# EAGLE schematic board1 (EAGLE 9.4.2)

## Sheet 1 of 2
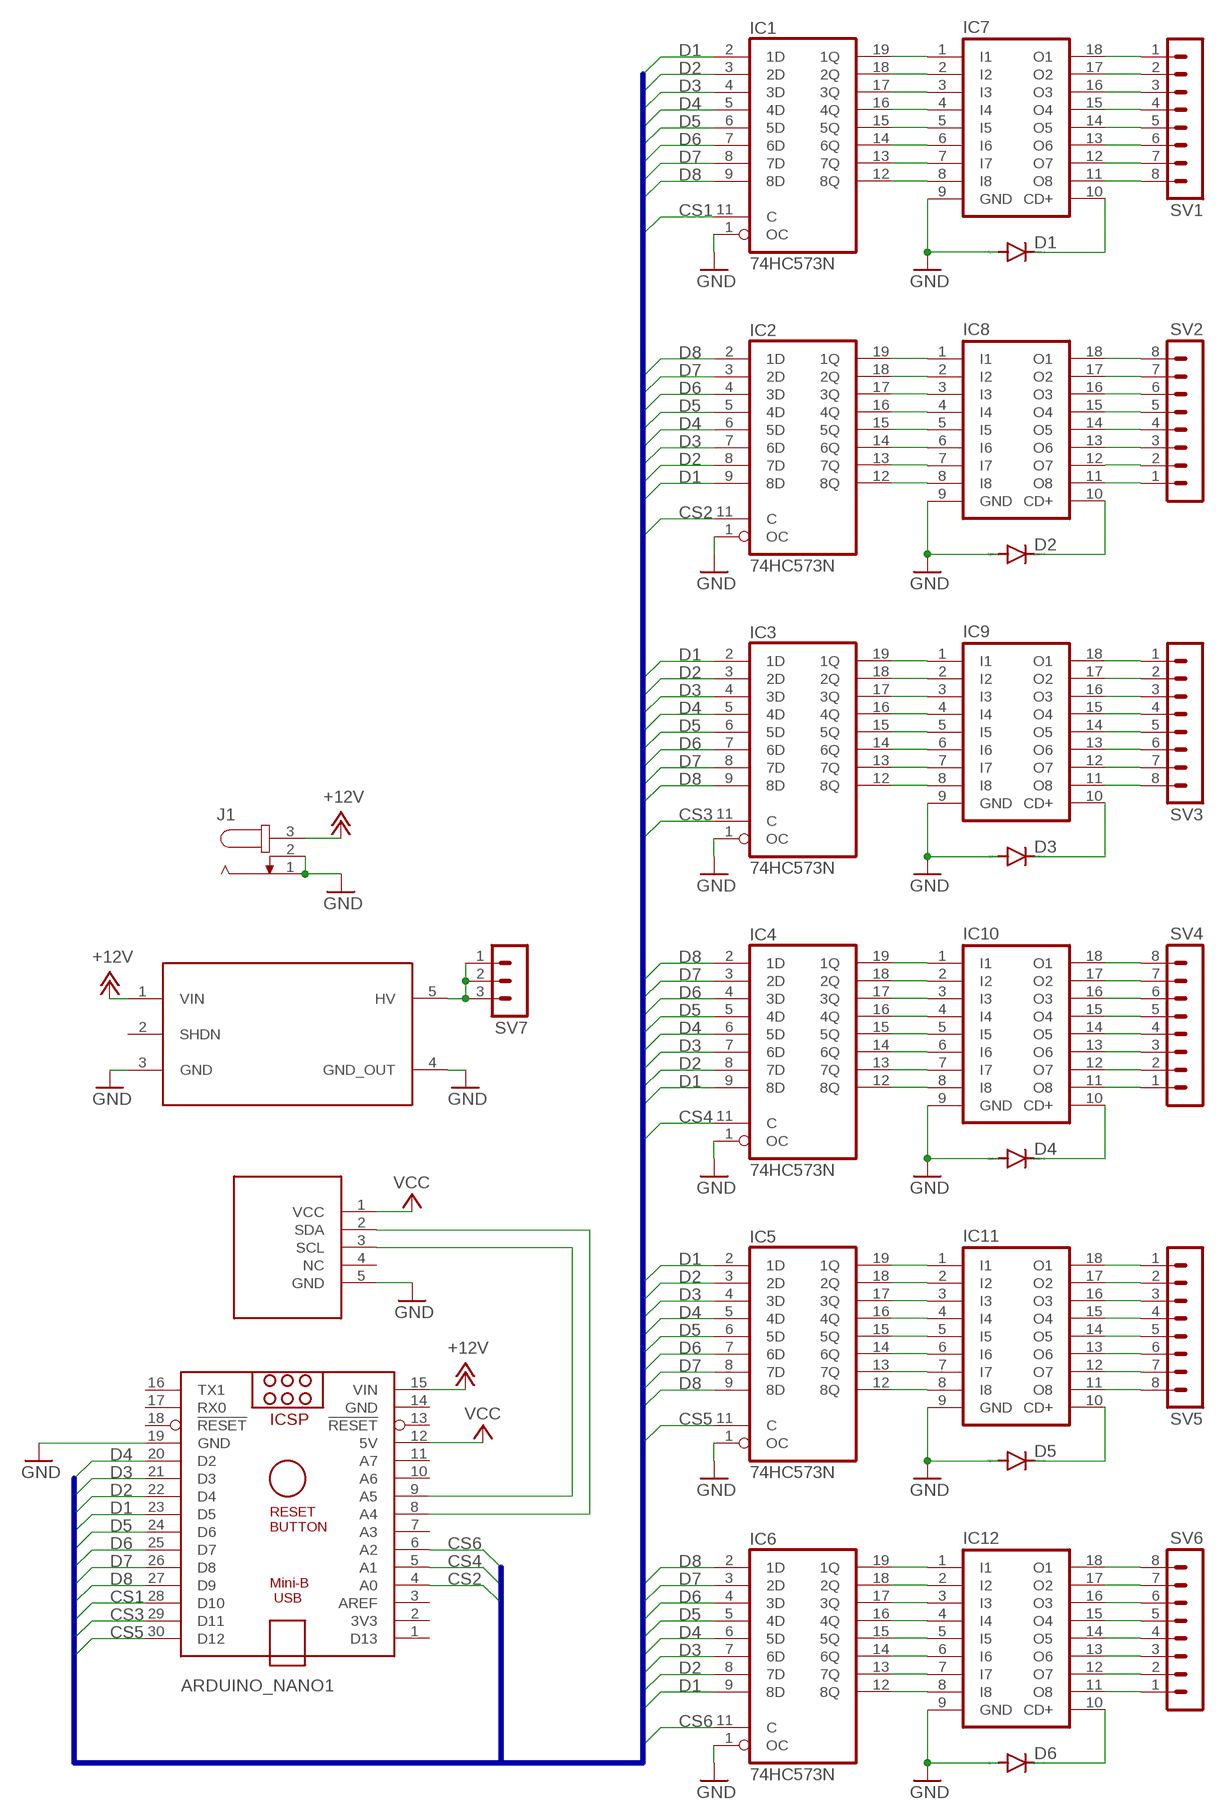
[diagram p0: schematic, sheet 1]

### Parts
ARDUINO_NANO1  ARDUINO_NANO  [ARDUINO_NANO]
D1  DIODE-D-7.5  [D-7.5]
D2  DIODE-D-7.5  [D-7.5]
D3  DIODE-D-7.5  [D-7.5]
D4  DIODE-D-7.5  [D-7.5]
D5  DIODE-D-7.5  [D-7.5]
D6  DIODE-D-7.5  [D-7.5]
IC1  74HC573N  [DIL20]
IC2  74HC573N  [DIL20]
IC3  74HC573N  [DIL20]
IC4  74HC573N  [DIL20]
IC5  74HC573N  [DIL20]
IC6  74HC573N  [DIL20]
IC7  ULN2803A  [DIL18]
IC8  ULN2803A  [DIL18]
IC9  ULN2803A  [DIL18]
IC10  ULN2803A  [DIL18]
IC11  ULN2803A  [DIL18]
IC12  ULN2803A  [DIL18]
J1  JACK-PLUG0  [SPC4077]
SV1  MA08-1  [MA08-1]
SV2  MA08-1  [MA08-1]
SV3  MA08-1  [MA08-1]
SV4  MA08-1  [MA08-1]
SV5  MA08-1  [MA08-1]
SV6  MA08-1  [MA08-1]
SV7  MA03-1  [MA03-1]
U$1  DS3231_MINI_MODULE  [DS3231_MINI_MODULE]
U$2  MAX1771_NIXIE_MODULE  [MAX1771_NIXIE_MODULE]

### Nets
+12V: ARDUINO_NANO1.15(VIN) J1.3 U$2.1(VIN)
CS1: ARDUINO_NANO1.28(D10) IC1.11(C)
CS2: ARDUINO_NANO1.4(A0) IC2.11(C)
CS3: ARDUINO_NANO1.29(D11) IC3.11(C)
CS4: ARDUINO_NANO1.5(A1) IC4.11(C)
CS5: ARDUINO_NANO1.30(D12) IC5.11(C)
CS6: ARDUINO_NANO1.6(A2) IC6.11(C)
D1: ARDUINO_NANO1.23(D5) IC1.2(1D) IC2.9(8D) IC3.2(1D) IC4.9(8D) IC5.2(1D) IC6.9(8D)
D2: ARDUINO_NANO1.22(D4) IC1.3(2D) IC2.8(7D) IC3.3(2D) IC4.8(7D) IC5.3(2D) IC6.8(7D)
D3: ARDUINO_NANO1.21(D3) IC1.4(3D) IC2.7(6D) IC3.4(3D) IC4.7(6D) IC5.4(3D) IC6.7(6D)
D4: ARDUINO_NANO1.20(D2) IC1.5(4D) IC2.6(5D) IC3.5(4D) IC4.6(5D) IC5.5(4D) IC6.6(5D)
D5: ARDUINO_NANO1.24(D6) IC1.6(5D) IC2.5(4D) IC3.6(5D) IC4.5(4D) IC5.6(5D) IC6.5(4D)
D6: ARDUINO_NANO1.25(D7) IC1.7(6D) IC2.4(3D) IC3.7(6D) IC4.4(3D) IC5.7(6D) IC6.4(3D)
D7: ARDUINO_NANO1.26(D8) IC1.8(7D) IC2.3(2D) IC3.8(7D) IC4.3(2D) IC5.8(7D) IC6.3(2D)
D8: ARDUINO_NANO1.27(D9) IC1.9(8D) IC2.2(1D) IC3.9(8D) IC4.2(1D) IC5.9(8D) IC6.2(1D)
GND: ARDUINO_NANO1.19(GND) D1.A D2.A D3.A D4.A D5.A D6.A IC1.1(OC) IC2.1(OC) IC3.1(OC) IC4.1(OC) IC5.1(OC) IC6.1(OC) IC7.9(GND) IC8.9(GND) IC9.9(GND) IC10.9(GND) IC11.9(GND) IC12.9(GND) J1.1 J1.2 U$1.5(GND) U$2.3(GND) U$2.4(GND_OUT)
N$1: IC2.19(1Q) IC8.1(I1)
N$2: IC2.18(2Q) IC8.2(I2)
N$3: IC2.17(3Q) IC8.3(I3)
N$4: IC2.16(4Q) IC8.4(I4)
N$5: IC2.15(5Q) IC8.5(I5)
N$6: IC2.14(6Q) IC8.6(I6)
N$7: IC2.13(7Q) IC8.7(I7)
N$8: IC2.12(8Q) IC8.8(I8)
N$9: IC1.19(1Q) IC7.1(I1)
N$10: IC1.18(2Q) IC7.2(I2)
N$11: IC1.17(3Q) IC7.3(I3)
N$12: IC1.16(4Q) IC7.4(I4)
N$13: IC1.15(5Q) IC7.5(I5)
N$14: IC1.14(6Q) IC7.6(I6)
N$15: IC1.13(7Q) IC7.7(I7)
N$16: IC1.12(8Q) IC7.8(I8)
N$17: IC3.19(1Q) IC9.1(I1)
N$18: IC3.18(2Q) IC9.2(I2)
N$19: IC3.17(3Q) IC9.3(I3)
N$20: IC3.16(4Q) IC9.4(I4)
N$21: IC3.15(5Q) IC9.5(I5)
N$22: IC3.14(6Q) IC9.6(I6)
N$23: IC3.13(7Q) IC9.7(I7)
N$24: IC3.12(8Q) IC9.8(I8)
N$25: IC4.19(1Q) IC10.1(I1)
N$26: IC4.18(2Q) IC10.2(I2)
N$27: IC4.17(3Q) IC10.3(I3)
N$28: IC4.16(4Q) IC10.4(I4)
N$29: IC4.15(5Q) IC10.5(I5)
N$30: IC4.14(6Q) IC10.6(I6)
N$31: IC4.13(7Q) IC10.7(I7)
N$32: IC4.12(8Q) IC10.8(I8)
N$33: IC5.19(1Q) IC11.1(I1)
N$34: IC5.18(2Q) IC11.2(I2)
N$35: IC5.17(3Q) IC11.3(I3)
N$36: IC5.16(4Q) IC11.4(I4)
N$37: IC5.15(5Q) IC11.5(I5)
N$38: IC5.14(6Q) IC11.6(I6)
N$39: IC5.13(7Q) IC11.7(I7)
N$40: IC5.12(8Q) IC11.8(I8)
N$41: IC6.19(1Q) IC12.1(I1)
N$42: IC6.18(2Q) IC12.2(I2)
N$43: IC6.17(3Q) IC12.3(I3)
N$44: IC6.16(4Q) IC12.4(I4)
N$45: IC6.15(5Q) IC12.5(I5)
N$46: IC6.14(6Q) IC12.6(I6)
N$47: IC6.13(7Q) IC12.7(I7)
N$48: IC6.12(8Q) IC12.8(I8)
N$49: IC7.18(O1) SV1.1
N$50: IC7.17(O2) SV1.2
N$51: IC7.16(O3) SV1.3
N$52: IC7.15(O4) SV1.4
N$53: IC7.14(O5) SV1.5
N$54: IC7.13(O6) SV1.6
N$55: IC7.12(O7) SV1.7
N$56: IC7.11(O8) SV1.8
N$57: IC8.18(O1) SV2.8
N$58: IC8.17(O2) SV2.7
N$59: IC8.16(O3) SV2.6
N$60: IC8.15(O4) SV2.5
N$61: IC8.14(O5) SV2.4
N$62: IC8.13(O6) SV2.3
N$63: IC8.12(O7) SV2.2
N$64: IC8.11(O8) SV2.1
N$65: IC9.18(O1) SV3.1
N$66: IC9.17(O2) SV3.2
N$67: IC9.16(O3) SV3.3
N$68: IC9.15(O4) SV3.4
N$69: IC9.14(O5) SV3.5
N$70: IC9.13(O6) SV3.6
N$71: IC9.12(O7) SV3.7
N$72: IC9.11(O8) SV3.8
N$73: IC10.18(O1) SV4.8
N$74: IC10.17(O2) SV4.7
N$75: IC10.16(O3) SV4.6
N$76: IC10.15(O4) SV4.5
N$77: IC10.14(O5) SV4.4
N$78: IC10.13(O6) SV4.3
N$79: IC10.12(O7) SV4.2
N$80: IC10.11(O8) SV4.1
N$81: IC11.18(O1) SV5.1
N$82: IC11.17(O2) SV5.2
N$83: IC11.16(O3) SV5.3
N$84: IC11.15(O4) SV5.4
N$85: IC11.14(O5) SV5.5
N$86: IC11.13(O6) SV5.6
N$87: IC11.12(O7) SV5.7
N$88: IC11.11(O8) SV5.8
N$89: IC12.18(O1) SV6.8
N$90: IC12.17(O2) SV6.7
N$91: IC12.16(O3) SV6.6
N$92: IC12.15(O4) SV6.5
N$93: IC12.14(O5) SV6.4
N$94: IC12.13(O6) SV6.3
N$95: IC12.12(O7) SV6.2
N$96: IC12.11(O8) SV6.1
N$97: ARDUINO_NANO1.8(A4) U$1.2(SDA)
N$98: D1.C IC7.10(CD+)
N$99: ARDUINO_NANO1.9(A5) U$1.3(SCL)
N$100: D2.C IC8.10(CD+)
N$101: SV7.1 SV7.2 SV7.3 U$2.5(HV)
N$102: D3.C IC9.10(CD+)
N$104: D4.C IC10.10(CD+)
N$106: D5.C IC11.10(CD+)
N$108: D6.C IC12.10(CD+)
VCC: ARDUINO_NANO1.12(5V) U$1.1(VCC)
Unconnected: ARDUINO_NANO1.1(D13) ARDUINO_NANO1.2(3V3) ARDUINO_NANO1.3(AREF) ARDUINO_NANO1.7(A3) ARDUINO_NANO1.10(A6) ARDUINO_NANO1.11(A7) ARDUINO_NANO1.13(!RESET) ARDUINO_NANO1.16(TX1) ARDUINO_NANO1.17(RX0) ARDUINO_NANO1.18(!RESET) U$1.4(NC) U$2.2(SHDN)

### Buses
CS1,CS2,CS3,CS4,CS5,CS6,D1,D2,D3,D4,D5,D6,D7,D8

## Sheet 2 of 2

## Power pins joined to a net without a drawn wire
GND: ARDUINO_NANO1.14(GND) IC1.10(GND) IC2.10(GND) IC3.10(GND) IC4.10(GND) IC5.10(GND) IC6.10(GND)
VCC: IC1.20(VCC) IC2.20(VCC) IC3.20(VCC) IC4.20(VCC) IC5.20(VCC) IC6.20(VCC)

## Library data of the parts
ARDUINO_NANO1 = ArduinoNanoV30:ARDUINO_NANO: Arduino Nano V3.0 Overview: The Arduino Nano is a small, complete, and breadboard-friendly board based on the ATmega328 (Arduino Nano 3.x) or ATmega168 (Arduino Nano 2.x). It has more or less the same functionality of the Arduino Duemilanove, but in a different package. It lacks only a DC power jack, and works with a Mini-B USB cable instead of a standard one. The Nano was designed and is being produced by Gravitech. Specifications: Microcontroller Atmel ATmega168 or ATmega328 Operating Voltage (logic level) 5 V Input Voltage (recommended) 7-12 V Input Voltage (limits) 6-20 V Digital I/O Pins 14 (of which 6 provide PWM output) Analog Input Pins 8 DC Current per I/O Pin 40 mA Flash Memory 16 KB (ATmega168) or 32 KB (ATmega328) of which 2 KB used by bootloader SRAM 1 KB (ATmega168) or 2 KB (ATmega328) EEPROM 512 bytes (ATmega168) or 1 KB (ATmega328) Clock Speed 16 MHz Dimensions 0.73" x 1.70" Length 45 mm Width 18 mm Weigth 5 g Power: The Arduino Nano can be powered via the Mini-B USB connection, 6-20V unregulated external power supply (pin 30), or 5V regulated external power supply (pin 27). The power source is automatically selected to the highest voltage source. Memory: The ATmega168 has 16 KB of flash memory for storing code (of which 2 KB is used for the bootloader); the ATmega328 has 32 KB, (also with 2 KB used for the bootloader). The ATmega168 has 1 KB of SRAM and 512 bytes of EEPROM (which can be read and written with the EEPROM library); the ATmega328 has 2 KB of SRAM and 1 KB of EEPROM. Input and Output: Each of the 14 digital pins on the Nano can be used as an input or output, using pinMode(), digitalWrite(), and digitalRead() functions. They operate at 5 volts. Each pin can provide or receive a maximum of 40 mA and has an internal pull-up resistor (disconnected by default) of 20-50 kOhms. In addition, some pins have specialized functions. Visit Arduino - ArduinoBoardNano <https://www.arduino.cc/en/Main/ArduinoBoardNano>
D1-D6 = diode:DIODE-: DIODE
IC1-IC6 = 74xx-eu:74*573: 8-bit D latch BUS DRIVER
IC7-IC12 = uln-udn:ULN2803A: DRIVER ARRAY
J1 = con-jack:JACK-PLUG: DC POWER JACK Power Jack, DC, Right Angle, Through Hole, Rated 5A at 16VDC, PC Terminals Distributor: Farnell (www.Farnell.de) Drawing: 84N1161.pdf / 84N1162.pdf Manufacturer: SPC Technology (www.spctechnology.com) Type: SPC4077 / SPC 4078; OC_FARNELL: unknown; OC_NEWARK: unknown
SV1-SV6 = con-lstb:MA08-1: PIN HEADER; OC_FARNELL: unknown; OC_NEWARK: unknown
SV7 = con-lstb:MA03-1: PIN HEADER; OC_FARNELL: unknown; OC_NEWARK: unknown
U$1 = random:DS3231_MINI_MODULE
U$2 = random:MAX1771_NIXIE_MODULE